# EAGLE schematic alu_slice (EAGLE 7.4.0)
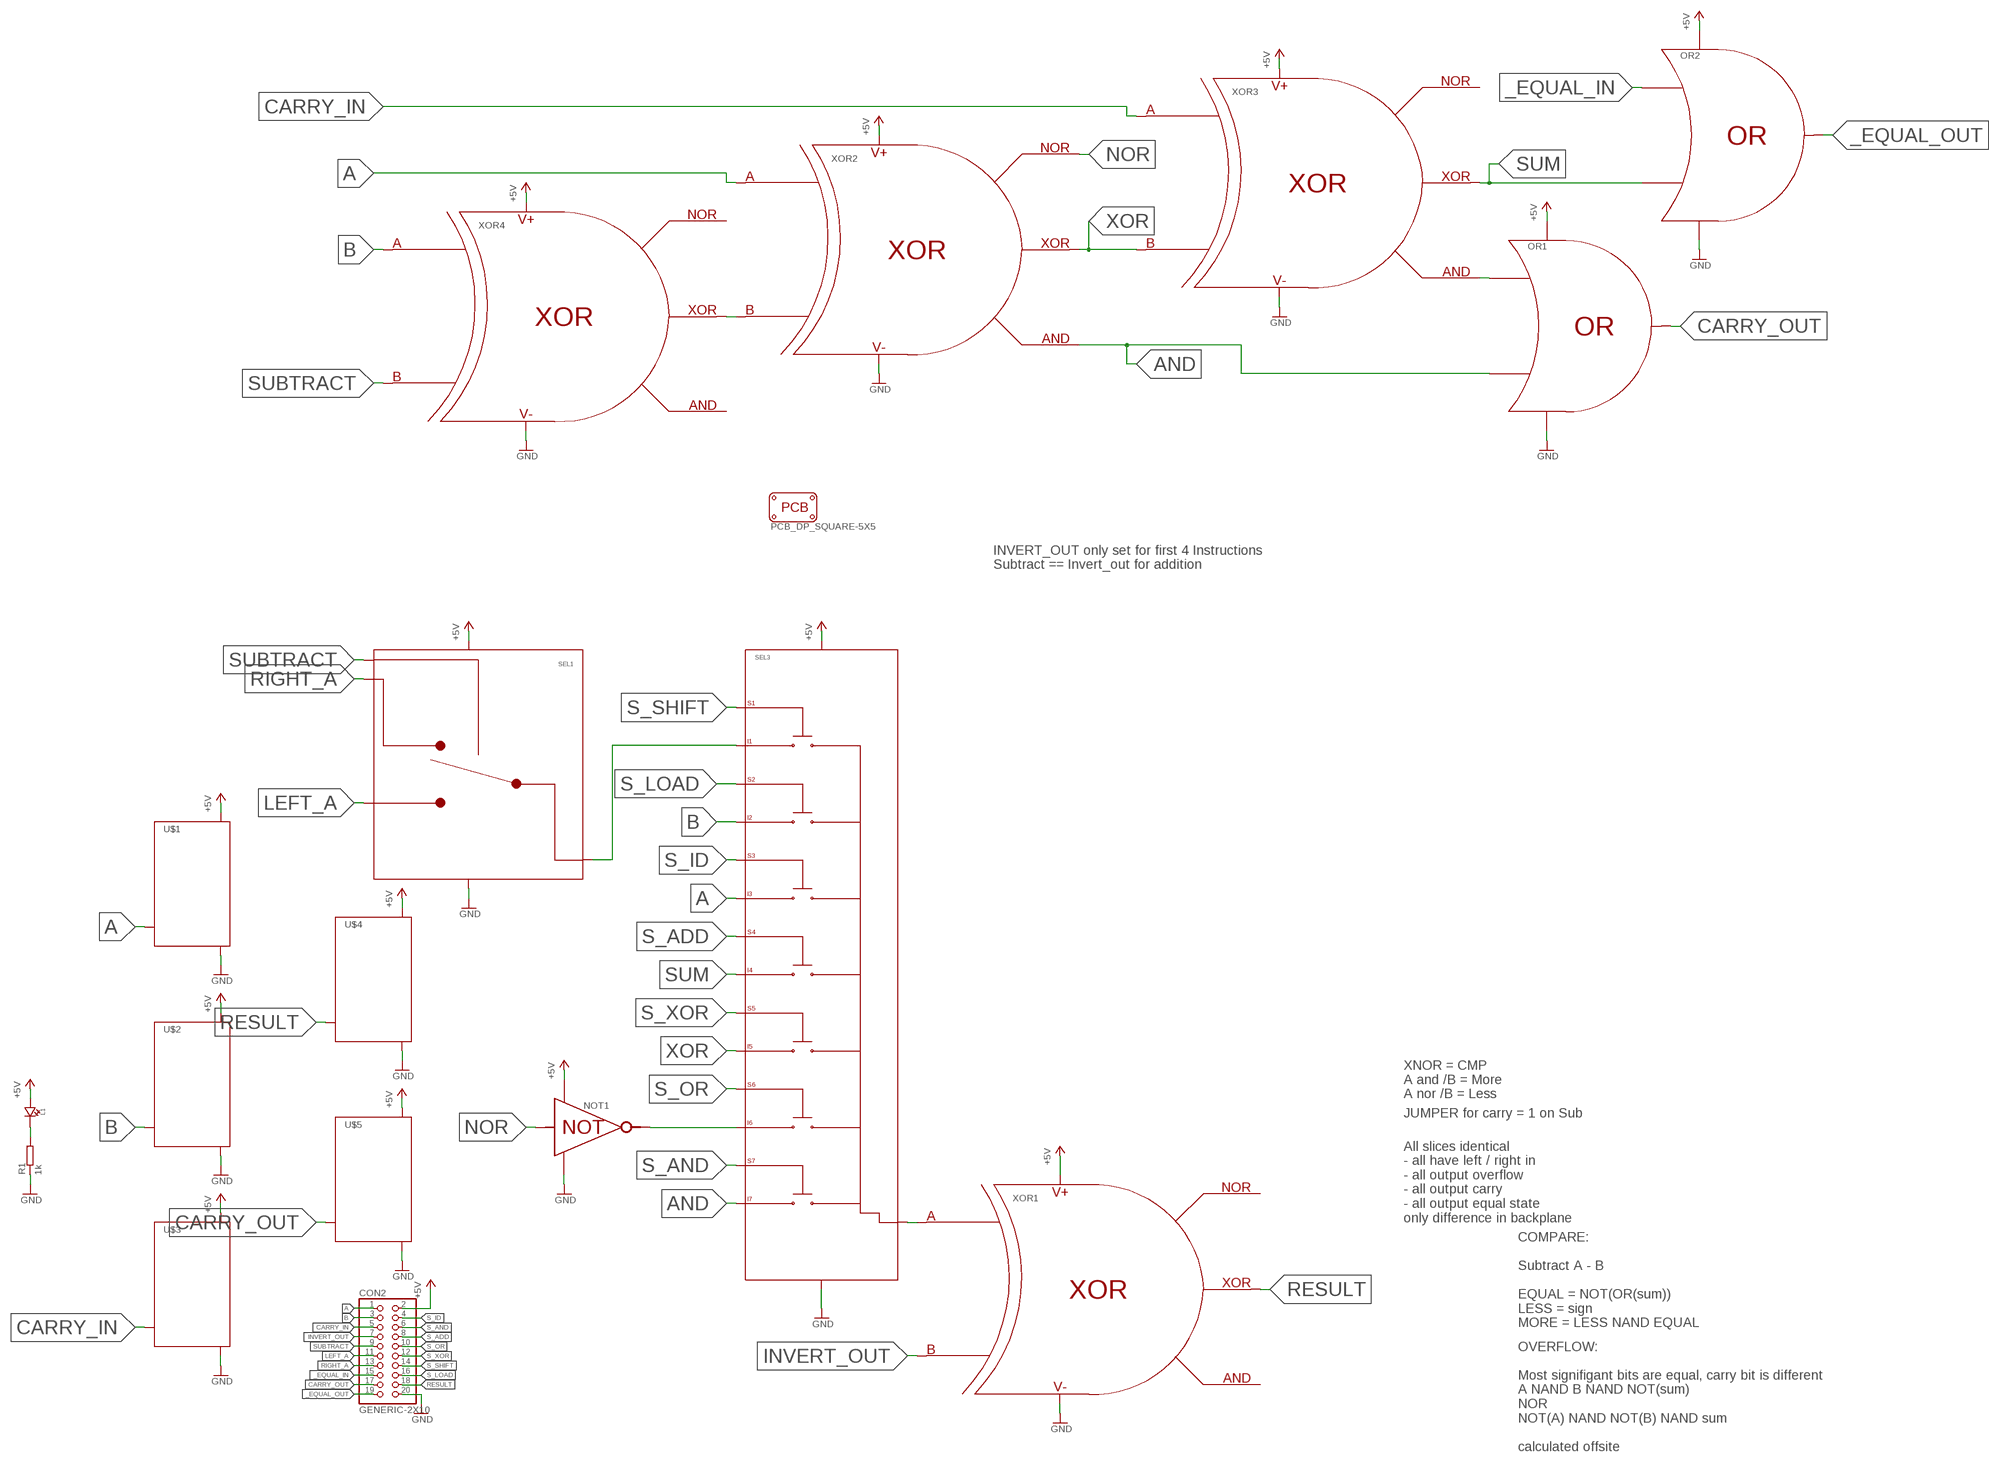
[diagram p0: schematic, sheet 1]

## Parts
CON2  GENERIC-2X10  [PINHEADER-100MIL-2X10-EDGE]
L1  LED0805  [CHIPLED_0805]
NOT1  NOTVERTICAL  [NOT-VERTICAL]
OR1  OR  [OR]
OR2  OR  [OR]
PCB1  PCB_DP_SQUARE-5X5  [DP5050_V1]
R1  1k  R-EU-MARKEDR0603  [R0603-MARK]
SEL1  1_BIT_SELECT  [SELECTOR-2-LANE-NOMUX]
SEL3  7_VAL_SELECT  [SELECTOR-7_BIT-NOMUX]
U$1  LEDDRIVER  [LEDDRIVER]
U$2  LEDDRIVER  [LEDDRIVER]
U$3  LEDDRIVER  [LEDDRIVER]
U$4  LEDDRIVER  [LEDDRIVER]
U$5  LEDDRIVER  [LEDDRIVER]
XOR1  XOR  [XOR]
XOR2  XOR  [XOR]
XOR3  XOR  [XOR]
XOR4  XOR  [XOR]

## Nets
+5V: CON2.2 L1.A NOT1._VP OR1._VP OR2._VP SEL1._VP SEL3._VP U$1._VP U$2._VP U$3._VP U$4._VP U$5._VP XOR1._VP XOR2._VP XOR3._VP XOR4._VP
_EQUAL_IN: CON2.15 OR2.A
_EQUAL_OUT: CON2.19 OR2.OR
A: CON2.1 SEL3.I3 U$1.A XOR2.A
AND: OR1.B SEL3.I7 XOR2.AND
B: CON2.3 SEL3.I2 U$2.A XOR4.A
CARRY_IN: CON2.5 U$3.A XOR3.A
CARRY_OUT: CON2.17 OR1.OR U$5.A
GND: CON2.20 NOT1._VN OR1._VN OR2._VN R1.1 SEL1._VN SEL3._VN U$1._VN U$2._VN U$3._VN U$4._VN U$5._VN XOR1._VN XOR2._VN XOR3._VN XOR4._VN
INVERT_OUT: CON2.7 XOR1.B
LEFT_A: CON2.11 SEL1.B
N$1: SEL3.OUT XOR1.A
N$2: XOR2.B XOR4.XOR
N$3: NOT1.NOT SEL3.I6
N$5: SEL1.OUT SEL3.I1
N$6: L1.C R1.2
N$8: OR1.A XOR3.AND
NOR: NOT1.A XOR2.NOR
RESULT: CON2.18 U$4.A XOR1.XOR
RIGHT_A: CON2.13 SEL1.A
S_ADD: CON2.8 SEL3.S4
S_AND: CON2.6 SEL3.S7
S_ID: CON2.4 SEL3.S3
S_LOAD: CON2.16 SEL3.S2
S_OR: CON2.10 SEL3.S6
S_SHIFT: CON2.14 SEL3.S1
S_XOR: CON2.12 SEL3.S5
SUBTRACT: CON2.9 SEL1.SEL XOR4.B
SUM: OR2.B SEL3.I4 XOR3.XOR
XOR: SEL3.I5 XOR2.XOR XOR3.B
Unconnected: XOR1.AND XOR1.NOR XOR3.NOR XOR4.AND XOR4.NOR

## Notes on the sheet
- INVERT_OUT only set for first 4 Instructions
  Subtract == Invert_out for addition
- XNOR = CMP
- A and /B = More
  A nor /B = Less
- JUMPER for carry = 1 on Sub
- All slices identical
  - all have left / right in
  - all output overflow
  - all output carry
  - all output equal state
  only difference in backplane
- COMPARE:
  
  Subtract A - B
  
  EQUAL = NOT(OR(sum))
  LESS = sign
  MORE = LESS NAND EQUAL
- OVERFLOW:
  
  Most signifigant bits are equal, carry bit is different
  A NAND B NAND NOT(sum)
  NOR
  NOT(A) NAND NOT(B) NAND sum
  
  calculated offsite

## Library data of the parts
CON2 = p.peter-connectors:GENERIC-2X10
L1 = p.peter-leds:LED
NOT1 = p.peter-gator:NOT
OR1 OR2 = p.peter-gator:OR
PCB1 = dp_pcb:PCB_DP_SQUARE: Dangerous Prototypes Standard Square PCB sizes
R1 = p.peter-rcl:R-EU-MARKED
SEL1 = p.peter-gator:1_BIT_SELECT
SEL3 = p.peter-gator:7_VAL_SELECT
U$1-U$5 = p.peter-gator:LEDDRIVER
XOR1-XOR4 = p.peter-gator:XOR